# Altium schematic sheet Power.SchDoc
size A4; SheetNumber: 2; SheetTotal: 2
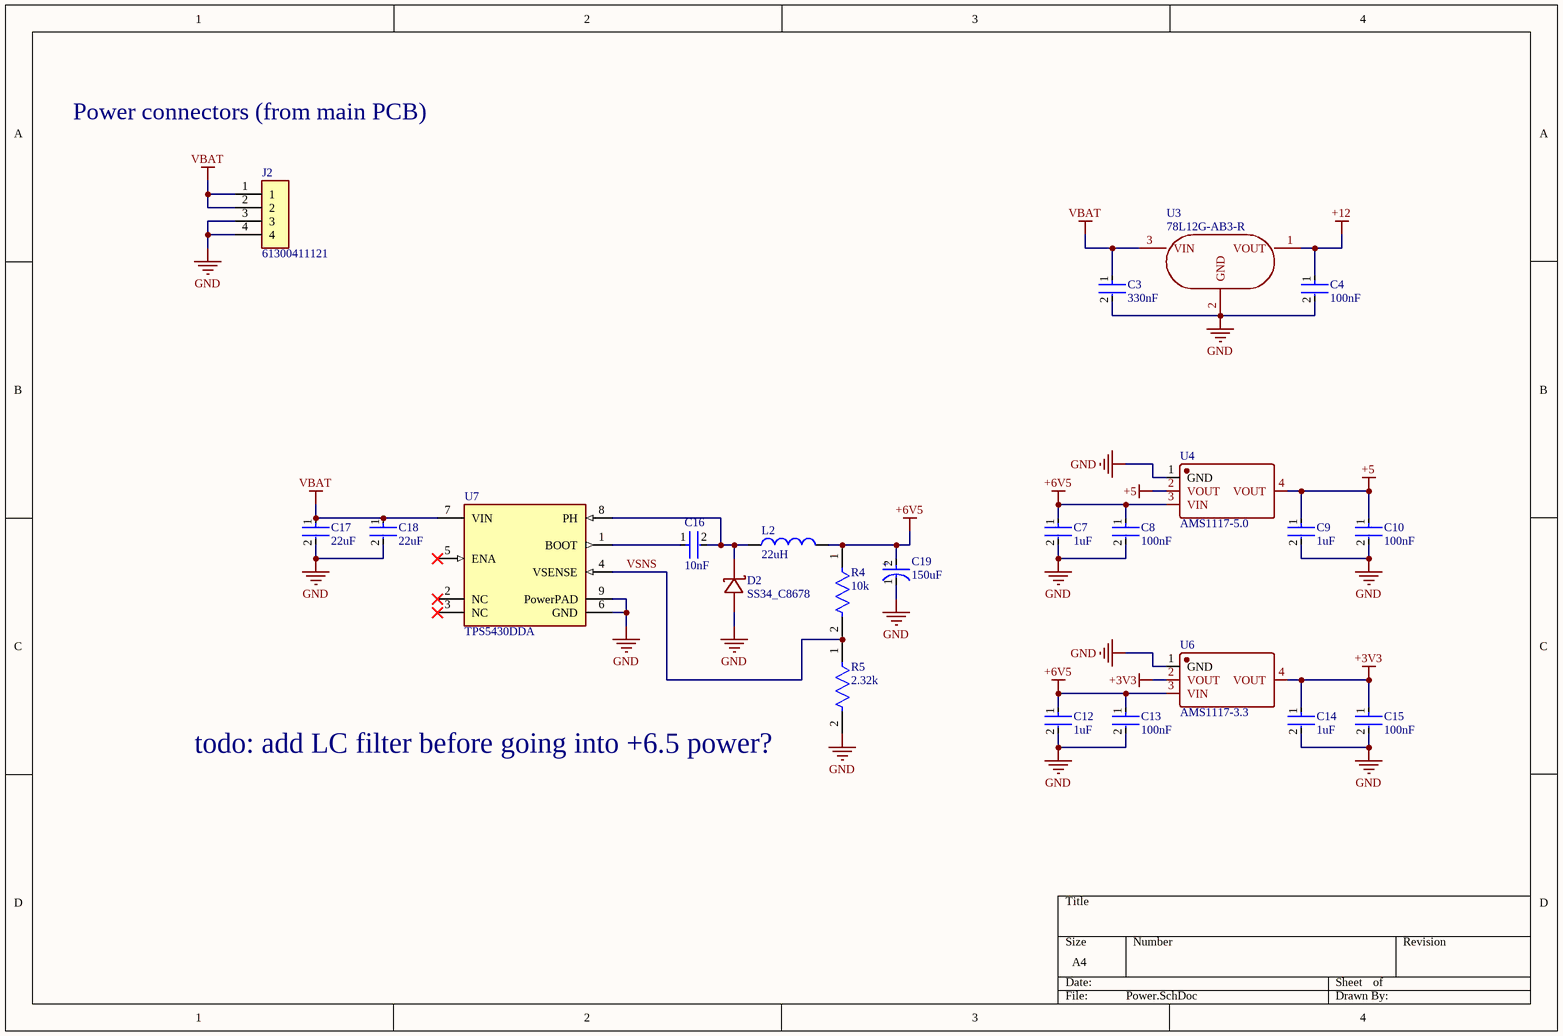
[diagram p0: Power.SchDoc]

## Parts
C3  330nF  [FP-GCM188-0_1-IPC_A]
C4  100nF  [FP-GCM188-0_1-IPC_A]
C7  1uF  [FP-CC0805-0_85-IPC_A]
C8  100nF  [FP-GCM188-0_1-IPC_A]
C9  1uF  [FP-CC0805-0_85-IPC_A]
C10  100nF  [FP-GCM188-0_1-IPC_A]
C12  1uF  [FP-CC0805-0_85-IPC_A]
C13  100nF  [FP-GCM188-0_1-IPC_A]
C14  1uF  [FP-CC0805-0_85-IPC_A]
C15  100nF  [FP-GCM188-0_1-IPC_A]
C16  10nF  [FP-GCM188-0_1-IPC_A]
C17  22uF  [FP-CC0805-0_85-IPC_A]
C18  22uF  [FP-CC0805-0_85-IPC_A]
C19  150uF  [FP-POSCAP-D3L-MFG]
D2  SS34_C8678  [SS34_C8678-Footprint-1]
J2  61300411121  [61300411121-Footprint-1]
L2  22uH  [INDP7066X28N]
R4  10k  [FP-RT0603-IPC_A]
R5  2.32k  [FP-RT0603-IPC_A]
U3  78L12G-AB3-R  [78L12G-AB3-R-Footprint-1]
U4  AMS1117-5.0  [AMS1117-5.0-Footprint-1]
U6  AMS1117-3.3  [AMS1117-5.0-Footprint-1]
U7  TPS5430DDA  [FP-DDA0008J-MFG]

## Nets
+3V3: C14.1 C15.1 U6.2(VOUT) U6.4(VOUT)
+5: C9.1 C10.1 U4.2(VOUT) U4.4(VOUT)
+6V5: C7.1 C8.1 C12.1 C13.1 C19.2(A) L2.2 R4.1 U4.3(VIN) U6.3(VIN)
+12: C4.1 U3.1(VOUT)
GND: C3.2 C4.2 C7.2 C8.2 C9.2 C10.2 C12.2 C13.2 C14.2 C15.2 C17.2 C18.2 C19.1(C) D2.2(A) J2.3 J2.4 R5.2 U3.2(GND) U4.1(GND) U6.1(GND) U7.6(GND) U7.9(PowerPAD)
VBAT: C3.1 C17.1 C18.1 J2.1 J2.2 U3.3(VIN) U7.7(VIN)
VSNS: R4.2 R5.1 U7.4(VSENSE)
NetC16_1: C16.1 U7.1(BOOT)
NetC16_2: C16.2 D2.1(K) L2.1 U7.8(PH)

Not connected (* = marked no-connect by the designer): U7 2(NC)* 3(NC)* 5(ENA)*

## Notes on the sheet
- Power connectors (from main PCB)
- (near R5) todo: add LC filter before going into +6.5 power?
- (in symbol CMP-00053-1) +

## Library data of the parts
C3 = CMP-00034-1: 50V 330nF X7R ±10% 0603 Multilayer Ceramic Capacitors MLCC - SMD/SMT ROHS
C4 C8 C10 C13 C15 = CMP-00033-2: 50V 100nF Ceramic Capacitor, Multilayer, Ceramic, 50V, 10% +Tol, 10% -Tol, X7R, 15% TC, 0.1uF, Surface Mount, 0603; Multilayer: Yes; Length: 1.6mm; Tolerance (fill in as +-): 10%; Height: 0.8mm; Max Operating Temperature: 125°C; Package Shape: Rectangular; Dielectric Material: Ceramic; Tolerance  (fill in as +-): 10%; Packaging: Tape and Reel; Terminal Finish: Nickel; Termination: Wraparound; Reach SVHC Compliant: Yes; Pins: 2; Value: 100nF; Case/Package: 0603; JESD-609 Code: e3; Rated DC Voltage (URdc): 50V; RoHS Compliant: Yes; Temperature Characteristics Code: X7R; Min Operating Temperature: -55°C; Capacitor Type: Ceramic; Width: 0.8mm; Mounting Technology: Surface Mount; Package Style: SMTMeter
C7 C9 C12 C14 = CMP-00018-1: Ceramic Capacitor, Multilayer, Ceramic, 50V, 10% +Tol, 10% -Tol, X7R, 15% TC, 1uF, Surface Mount, 0805; Multilayer: Yes; Temperature Characteristics Code: X7R; Reach SVHC Compliant: Yes; Package Shape: Rectangular; Dielectric Material: Ceramic; Packaging: Tape and Reel; Capacitor Type: Ceramic; Package Style: SMTMeter; Length: 2mm; Terminal Finish: Nickel; Case/Package: 0805; JESD-609 Code: e3; Termination: Wraparound; Width: 1.25mm; Tolerance  (fill in as +-): 10%; Max Operating Temperature: 125°C; Pins: 2; Rated DC Voltage (URdc): 50V; Mounting Technology: Surface Mount; Tolerance (fill in as +-): 10%; Height: 1.25mm; Min Operating Temperature: -55°C; Value: 1uF; RoHS Compliant: Yes
C16 = CMP-00050-1: 50V 10nF ceramic 0603 capacitor
C17 C18 = CMP-00049-1: 35V 22uF X5R 卤20% 0805 Multilayer Ceramic Capacitors MLCC - SMD/SMT ROHS
C19 = CMP-00053-1: Tantalum Capacitor, Polarized, Tantalum (solid Polymer), 16V, 20% +Tol, 20% -Tol, 150uF, Surface Mount, 2917; Manufacturer Series: TQC; Ripple Current: 1.8A; Tan Delta: 0.1; Leakage Current: 240uA; Max Operating Temperature: 105°C; Package Shape: Rectangular; Pins: 2; Polarity: Polarized; Value: 150uF; Min Operating Temperature: -55°C; Tolerance  (fill in as +-): 20%; Termination: Wraparound; Tolerance (fill in as +-): 20%; Reach SVHC Compliant: Yes; Case/Package: 2917; Capacitor Type: Tantalum; Dielectric Material: Polymer; RoHS Compliant: Yes; Mounting Technology: Surface Mount; Rated DC Voltage (URdc): 16V
D2 = CMP-004-00031-2: SS34 40V 3A Schottky Diode
J2 = CMP-00039-3: 4P Single Row 2.54mm Wurth Elektronik Header Pin (inverted 3D model); System: Connector
L2 = CMP-00051-1: 2.5A 22uH Integrated molded inductor ±20% 3A SMD,6.6x7mm Power Inductors ROHS
R4 = CMP-00035-1: 10k 1% Fixed Resistor, Metal Glaze/thick Film, 0.1W, 10000ohm, 75V, 1% +/-Tol, 100ppm/Cel, Surface Mount, 0603; Power: 100mW; Temperature Coefficient (ppm/Cel): 100; Package Height: 0.45mm; Package Length: 1.6mm; Additional Feature: LASER TRIMMABLE; Package Width: 0.8mm; Value: 10kR; Rated Temperature: 70°C; Construction: Chip; Resistor Type: FIXED RESISTOR; Terminal Finish: Nickel; Mounting Technology: Surface Mount; Technology: METAL GLAZE/THICK FILM; Min Operating Temperature: -55°C; Pins: 2; Termination: Wraparound; Working Voltage: 75V; RoHS Compliant: Yes; Packaging: Tape and Reel; Case/Package: 0603; JESD-609 Code: e3; Package Shape: Rectangular; Reach SVHC Compliant: Yes; Max Operating Temperature: 155°C; Tolerance: 1%
R5 = CMP-00052-2: 2.32k 1% Fixed Resistor, Metal Glaze/thick Film, 0.1W, 2320ohm, 75V, 1% +/-Tol, 100ppm/Cel, Surface Mount, 0603; Rated Temperature: 70°C; Package Length: 1.6mm; Temperature Coefficient (ppm/Cel): 100; Value: 2.32kR; Package Height: 0.45mm; Power: 100mW; Package Width: 0.8mm; Additional Feature: LASER TRIMMABLE; Technology: METAL GLAZE/THICK FILM; RoHS Compliant: Yes; JESD-609 Code: e3; Construction: Chip; Package Shape: Rectangular; Working Voltage: 75V; Reach SVHC Compliant: Yes; Terminal Finish: Nickel; Packaging: Tape and Reel; Pins: 2; Max Operating Temperature: 155°C; Mounting Technology: Surface Mount; Resistor Type: FIXED RESISTOR; Case/Package: 0603; Tolerance: 1%; Min Operating Temperature: -55°C; Termination: Wraparound
U3 = CMP-00000-1: 12V 100mA LDO Regulator
U4 = CMP-00001-2: 5V Reg
U6 = CMP-00009-2: 3.3V Reg
U7 = CMP-00048-3: Switching Regulator, Voltage-mode, 6A, 500kHz Switching Freq-Max, PDSO8; Control Technique: PULSE WIDTH MODULATION; Switcher Configuration: BUCK; Channels: 1; Package Equivalence Code: SOP8,.25; Min Input Voltage: 5.5V; Package Body Material: Plastic; Frequency: 600kHz; Nominal Supply Voltage: 12V; Max Supply Voltage: 36V; Qualification Status: Not Qualified; Terminal Finish: Nickel; Min Operating Temperature: -40°C; Temperature Grade: AUTOMOTIVE; JESD-30 Code: R-PDSO-G8; Control Mode: VOLTAGE-MODE; Terminal Pitch: 1.27mm; Package Shape: Rectangular; Length: 4.89mm; Width: 3.9mm; RoHS Compliant: Yes; Technology: MOS; Max Operating Temperature: 125°C; Moisture Sensitivity Level: 1; Reach SVHC Compliant: Yes; JESD-609 Code: e4; Peak Reflow Temperature (Cel): 260°C; Package Style: SMALL OUTLINE, HEAT SINK/SLUG, LOW PROFILEMeter; Max Output current: 6A; Throw Configuration: SWITCHING REGULATOR; Terminal Form: Gull Wing; Height - Seated (Max): 1.68mm; Pins: 8; Surface Mount: Yes; Case/Package: HLSOP; Terminal Position: DUAL